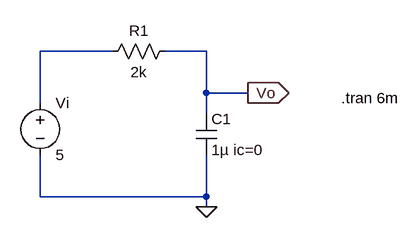
[diagram p0: schematic Circuito del ejercicio 6.asc]
Circuito del ejercicio 6.asc, the LTspice schematic file:
Version 4
SHEET 1 880 680
WIRE 176 64 64 64
WIRE 320 64 256 64
WIRE 320 128 320 64
WIRE 384 128 320 128
WIRE 64 144 64 64
WIRE 320 160 320 128
WIRE 64 288 64 224
WIRE 320 288 320 224
WIRE 320 288 64 288
WIRE 320 304 320 288
FLAG 320 304 0
FLAG 384 128 Vo
IOPIN 384 128 Out
SYMBOL voltage 64 128 R0
SYMATTR InstName Vi
SYMATTR Value 5
SYMBOL res 272 48 R90
WINDOW 0 0 56 VBottom 2
WINDOW 3 32 56 VTop 2
SYMATTR InstName R1
SYMATTR Value 2k
SYMBOL cap 304 160 R0
SYMATTR InstName C1
SYMATTR Value 1µ ic=0
TEXT 528 136 Left 2 !.tran 6m

The netlist it stands for:
* Circuito del ejercicio 6.asc
Vi N001 0 5
R1 Vo N001 2k
C1 Vo 0 1µ ic=0
.tran 6m
.backanno
.end

* Results of the author's LTspice run, read from the files saved beside the schematic
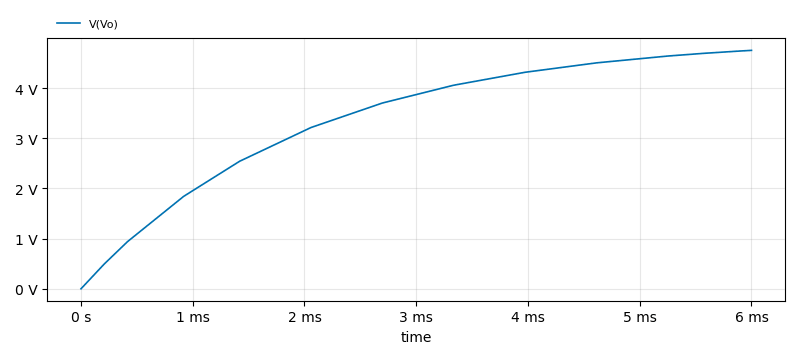
[diagram p1: Transient Analysis of Circuito del ejercicio 6.asc, plotted from the saved traces]
* Transient Analysis, 1 run:
*   V(Vo): min 2.5 µV, max 4.751 V, average 3.407 V, rms 3.647 V, last 4.751 V